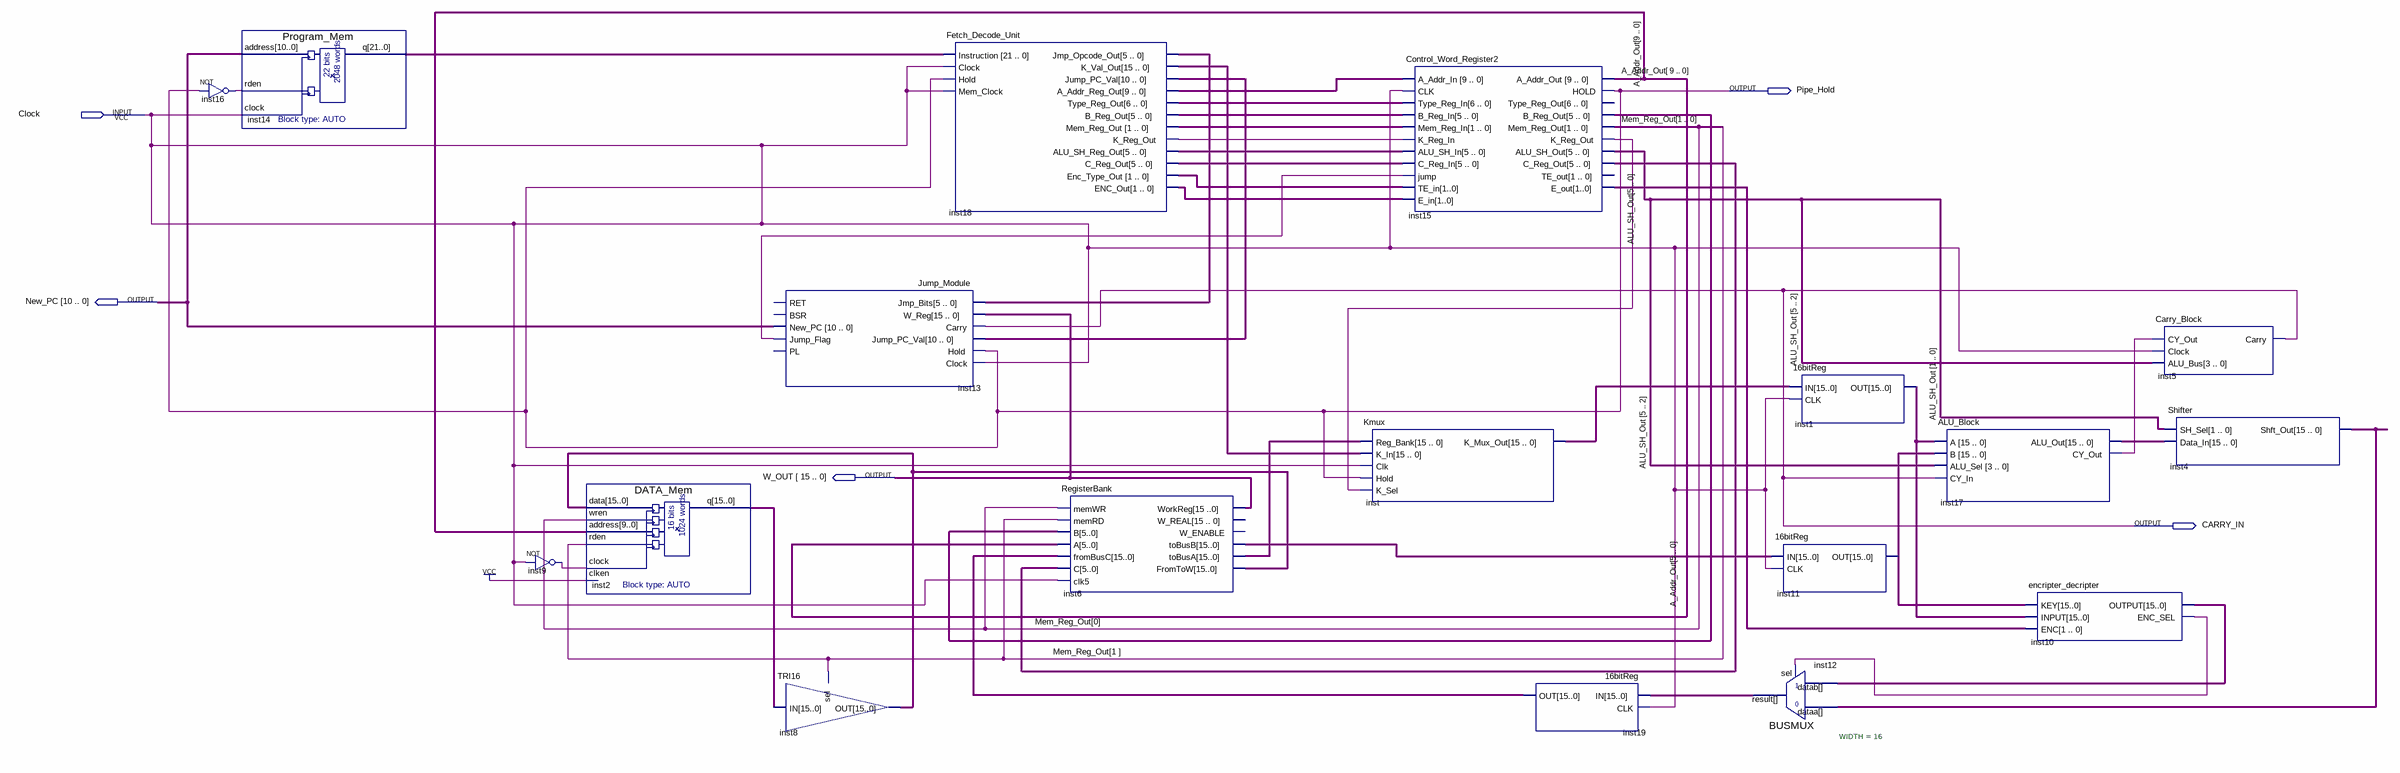
[diagram p0: schematic sheet]
// Quartus schematic TP2_E5.bdf as structural Verilog: 18 symbols, 5 pins
module TP2_E5 (
  input  Clock,
  output Pipe_Hold,
  output [10:0] New_PC,
  output [15:0] W_OUT,
  output CARRY_IN
);

  wire inst9_out, inst10_enc_sel, inst13_jump_flag, inst15_k_reg_out, inst16_out, inst17_cy_out,
       inst18_k_reg_out;
  wire [1:0] inst15_e_out, inst18_enc_out, inst18_enc_type_out, inst18_mem_reg_out, Mem_Reg_Out;
  wire [5:0] ALU_SH_Out, inst15_b_reg_out, inst15_c_reg_out, inst18_alu_sh_reg_out, inst18_b_reg_out,
       inst18_c_reg_out, inst18_jmp_opcode_out;
  wire [6:0] inst18_type_reg_out;
  wire [9:0] A_Addr_Out, inst18_a_addr_reg_out;
  wire [10:0] inst18_jump_pc_val;
  wire [15:0] inst1_out, inst2_q, inst4_shft_out, inst6_tobusa, inst6_tobusb, inst8_out, inst10_output,
       inst11_out, inst12_result, inst17_alu_out, inst18_k_val_out, inst19_out, inst_k_mux_out;
  wire [21:0] inst14_q;

  not inst16 (inst16_out, Pipe_Hold);
  Program_Mem inst14 (.address(New_PC), .rden(inst16_out), .clock(Clock), .q(inst14_q));
  not inst9 (inst9_out, Clock);
  DATA_Mem inst2 (
    .data(inst8_out), .wren(Mem_Reg_Out[0]), .address(A_Addr_Out), .rden(Mem_Reg_Out[1]), .clock(inst9_out),
    .clken(1'b1), .q(inst2_q));
  Jump_Module inst13 (
    .Jmp_Bits(inst18_jmp_opcode_out), .W_Reg(W_OUT), .Carry(CARRY_IN), .Jump_PC_Val(inst18_jump_pc_val),
    .Hold(Pipe_Hold), .Clock(Clock), .New_PC(New_PC), .Jump_Flag(inst13_jump_flag));  // open: RET, BSR, PL
  TRI16 inst8 (.sel(Mem_Reg_Out[1]), .IN(inst2_q), .OUT(inst8_out));
  Fetch_Decode_Unit inst18 (
    .Instruction(inst14_q), .Clock(Clock), .Hold(Pipe_Hold), .Mem_Clock(Clock),
    .Jmp_Opcode_Out(inst18_jmp_opcode_out), .K_Val_Out(inst18_k_val_out), .Jump_PC_Val(inst18_jump_pc_val),
    .A_Addr_Reg_Out(inst18_a_addr_reg_out), .Type_Reg_Out(inst18_type_reg_out), .B_Reg_Out(inst18_b_reg_out),
    .Mem_Reg_Out(inst18_mem_reg_out), .K_Reg_Out(inst18_k_reg_out), .ALU_SH_Reg_Out(inst18_alu_sh_reg_out),
    .C_Reg_Out(inst18_c_reg_out), .Enc_Type_Out(inst18_enc_type_out), .ENC_Out(inst18_enc_out));
  RegisterBank inst6 (
    .memWR(Mem_Reg_Out[0]), .memRD(Mem_Reg_Out[1]), .B(inst15_b_reg_out), .A(A_Addr_Out[5:0]),
    .fromBusC(inst19_out), .C(inst15_c_reg_out), .clk5(Clock), .WorkReg(W_OUT), .toBusB(inst6_tobusb),
    .toBusA(inst6_tobusa), .FromToW(inst8_out));  // open: W_REAL, W_ENABLE
  Kmux inst (
    .Reg_Bank(inst6_tobusa), .K_In(inst18_k_val_out), .Clk(Clock), .Hold(Pipe_Hold),
    .K_Sel(inst15_k_reg_out), .K_Mux_Out(inst_k_mux_out));
  Control_Word_Register2 inst15 (
    .A_Addr_In(inst18_a_addr_reg_out), .CLK(Clock), .Type_Reg_In(inst18_type_reg_out),
    .B_Reg_In(inst18_b_reg_out), .Mem_Reg_In(inst18_mem_reg_out), .K_Reg_In(inst18_k_reg_out),
    .ALU_SH_In(inst18_alu_sh_reg_out), .C_Reg_In(inst18_c_reg_out), .jump(inst13_jump_flag),
    .TE_in(inst18_enc_type_out), .E_in(inst18_enc_out), .A_Addr_Out(A_Addr_Out), .HOLD(Pipe_Hold),
    .B_Reg_Out(inst15_b_reg_out), .Mem_Reg_Out(Mem_Reg_Out), .K_Reg_Out(inst15_k_reg_out),
    .ALU_SH_Out(ALU_SH_Out), .C_Reg_Out(inst15_c_reg_out), .E_out(inst15_e_out));  // open: Type_Reg_Out, TE_out
  \16bitReg  inst19 (.IN(inst12_result), .CLK(Clock), .OUT(inst19_out));
  \16bitReg  inst1 (.IN(inst_k_mux_out), .CLK(Clock), .OUT(inst1_out));
  \16bitReg  inst11 (.IN(inst6_tobusb), .CLK(Clock), .OUT(inst11_out));
  BUSMUX #(.WIDTH(16)) inst12 (
    .datab(inst10_output), .sel(inst10_enc_sel), .dataa(inst4_shft_out), .result(inst12_result));
  ALU_Block inst17 (
    .A(inst1_out), .B(inst11_out), .ALU_Sel(ALU_SH_Out[5:2]), .CY_In(CARRY_IN), .ALU_Out(inst17_alu_out),
    .CY_Out(inst17_cy_out));
  encripter_decripter inst10 (
    .KEY(inst11_out), .INPUT(inst1_out), .ENC(inst15_e_out), .OUTPUT(inst10_output), .ENC_SEL(inst10_enc_sel));
  Carry_Block inst5 (.CY_Out(inst17_cy_out), .Clock(Clock), .ALU_Bus(ALU_SH_Out[5:2]), .Carry(CARRY_IN));
  Shifter inst4 (.SH_Sel(ALU_SH_Out[1:0]), .Data_In(inst17_alu_out), .Shft_Out(inst4_shft_out));
endmodule
